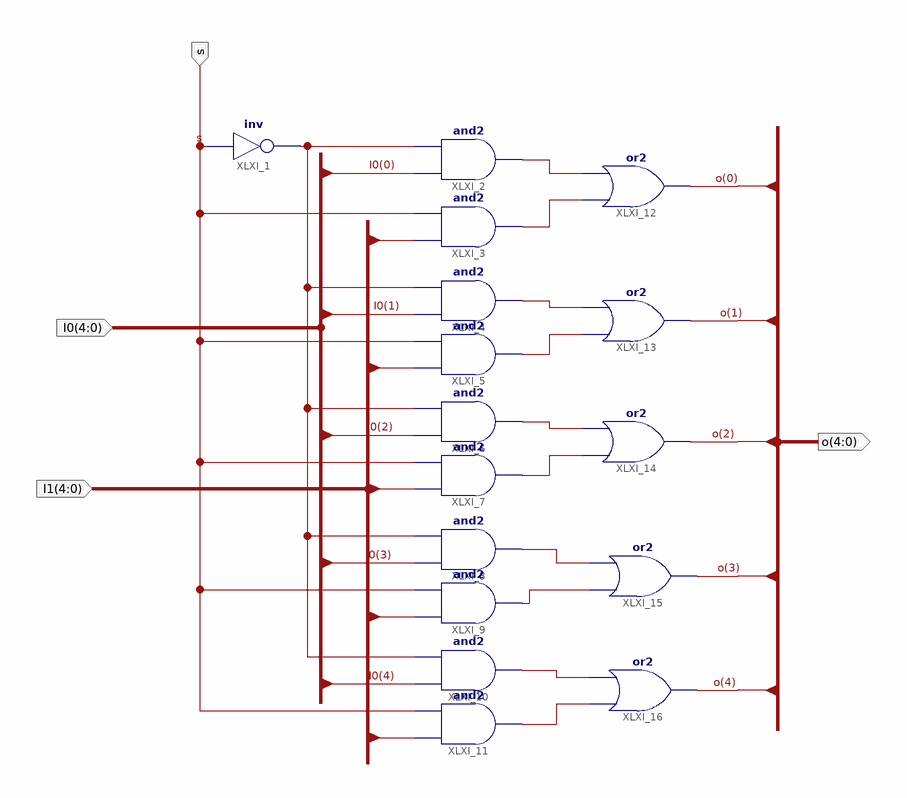
[diagram p0: schematic sheet 1]
// Xilinx ISE schematic MUX2T1_5.sch (kintex7) as structural Verilog: 16 symbols, 4 ports
module MUX2T1_5 (
  input  s,
  input  [4:0] I0,
  input  [4:0] I1,
  output [4:0] o
);

  wire XLXN_2, XLXN_36, XLXN_37, XLXN_38, XLXN_39, XLXN_40, XLXN_41, XLXN_42, XLXN_43, XLXN_44, XLXN_45;

  not XLXI_1 (XLXN_2, s);
  and XLXI_2 (XLXN_36, I0[0], XLXN_2);
  and XLXI_3 (XLXN_37, I1[0], s);
  and XLXI_4 (XLXN_38, I0[1], XLXN_2);
  and XLXI_5 (XLXN_39, I1[1], s);
  and XLXI_6 (XLXN_40, I0[2], XLXN_2);
  and XLXI_7 (XLXN_41, I1[2], s);
  and XLXI_8 (XLXN_42, I0[3], XLXN_2);
  and XLXI_9 (XLXN_43, I1[3], s);
  and XLXI_10 (XLXN_44, I0[4], XLXN_2);
  and XLXI_11 (XLXN_45, I1[4], s);
  or XLXI_12 (o[0], XLXN_37, XLXN_36);
  or XLXI_13 (o[1], XLXN_39, XLXN_38);
  or XLXI_14 (o[2], XLXN_41, XLXN_40);
  or XLXI_15 (o[3], XLXN_43, XLXN_42);
  or XLXI_16 (o[4], XLXN_45, XLXN_44);
endmodule
